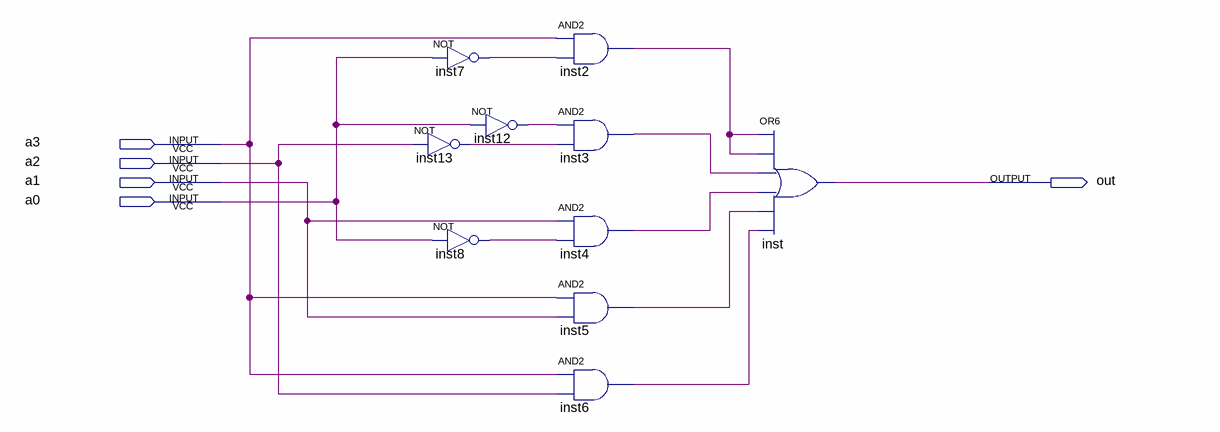
[diagram p0: schematic sheet]
// Quartus schematic FuncE.bdf as structural Verilog: 10 symbols, 5 pins
module FuncE (
  input  a3,
  input  a2,
  input  a1,
  input  a0,
  output out
);

  wire inst2_out, inst3_out, inst4_out, inst5_out, inst6_out, inst7_out, inst8_out, inst12_out, inst13_out;

  not inst7 (inst7_out, a0);
  not inst12 (inst12_out, a0);
  not inst13 (inst13_out, a2);
  not inst8 (inst8_out, a0);
  and inst2 (inst2_out, a3, inst7_out);
  and inst3 (inst3_out, inst12_out, inst13_out);
  and inst4 (inst4_out, a1, inst8_out);
  and inst5 (inst5_out, a3, a1);
  and inst6 (inst6_out, a3, a2);
  or inst (out, inst2_out, inst2_out, inst3_out, inst4_out, inst5_out, inst6_out);
endmodule
